# Altium project V5_BASE.PrjPcb
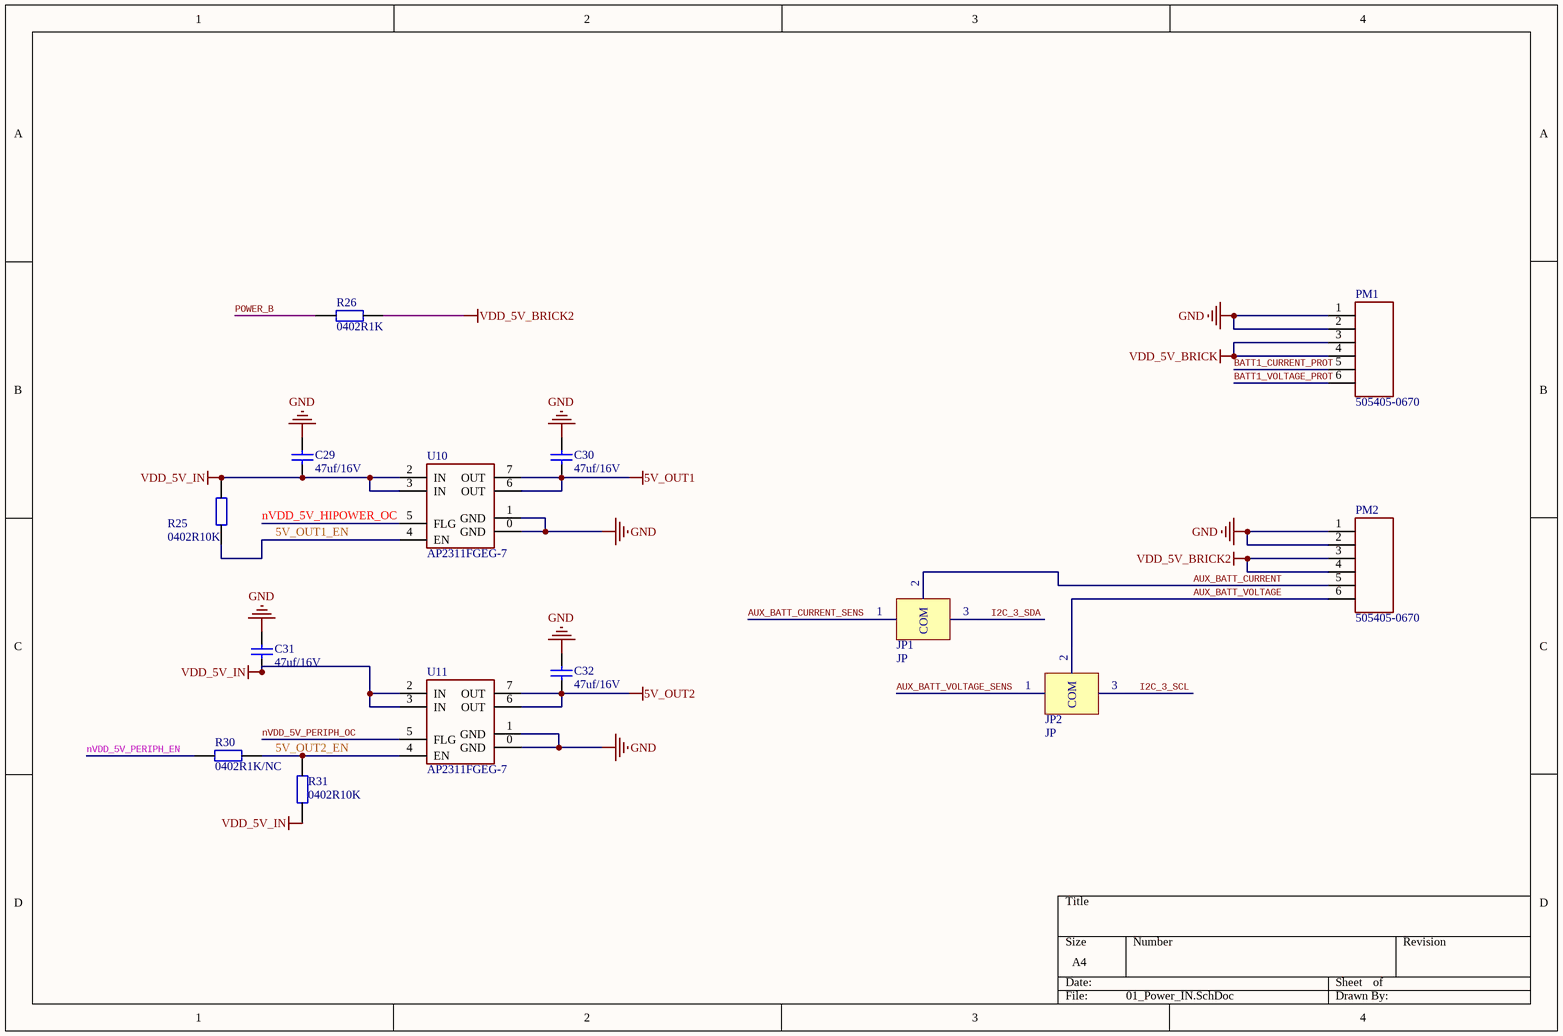
[diagram p0: 01_Power_IN.SchDoc]
3 sheets, 57 parts. Net scope: global (net labels, ports and power ports of the same name join across sheets).
Board file: V5_BASE_V15.PcbDoc
Sheets:
  01_Power_IN.SchDoc
  03_Power_Switch.SchDoc
  04_POWER_LDO.SchDoc

## Sheet 01_Power_IN.SchDoc
size A4

### Parts
C29  47uf/16V  [0805CAP]
C30  47uf/16V  [0805CAP]
C31  47uf/16V  [0805CAP]
C32  47uf/16V  [0805CAP]
JP1  JP  [0402R-SR]
JP2  JP  [0402R-SR]
PM1  505405-0670  [5054050660]
PM2  505405-0670  [5054050660]
R25  0402R10K  [0402R]
R26  0402R1K  [0402R]
R30  0402R1K/NC  [0402R]
R31  0402R10K  [0402R]
U10  AP2311FGEG-7  [QFN8_0.65]
U11  AP2311FGEG-7  [QFN8_0.65]

### Nets
5V_OUT1: C30.1 U10.6(OUT) U10.7(OUT)
5V_OUT2: C32.1 U11.6(OUT) U11.7(OUT)
GND: C29.2 C30.2 C31.2 C32.2 PM1.1 PM1.2 PM2.1 PM2.2 U10.0(GND) U10.1(GND) U11.0(GND) U11.1(GND)
VDD_5V_BRICK: PM1.3 PM1.4
VDD_5V_BRICK2: PM2.3 PM2.4 R26.2
VDD_5V_IN: C29.1 C31.1 R25.2 R31.2 U10.2(IN) U10.3(IN) U11.2(IN) U11.3(IN)  [project net VCC]
5V_OUT1_EN: R25.1 U10.4(EN)
5V_OUT2_EN: R30.1 R31.1 U11.4(EN)
AUX_BATT_CURRENT: JP1.2(COM) PM2.5
AUX_BATT_CURRENT_SENS: JP1.1
AUX_BATT_VOLTAGE: JP2.2(COM) PM2.6
AUX_BATT_VOLTAGE_SENS: JP2.1
BATT1_CURRENT_PROT: PM1.5
BATT1_VOLTAGE_PROT: PM1.6
I2C_3_SCL: JP2.3
I2C_3_SDA: JP1.3
nVDD_5V_HIPOWER_OC: U10.5(FLG)
nVDD_5V_PERIPH_EN: R30.2
nVDD_5V_PERIPH_OC: U11.5(FLG)
POWER_B: R26.1

### Library data of the parts
C29-C32 = Cap: Capacitor
JP1 JP2 = 0402R-SR
PM1 PM2 = 5054050660
R25 R26 R30 R31 = 0402R1K: 0402R1K 1%

## Sheet 03_Power_Switch.SchDoc
size A4
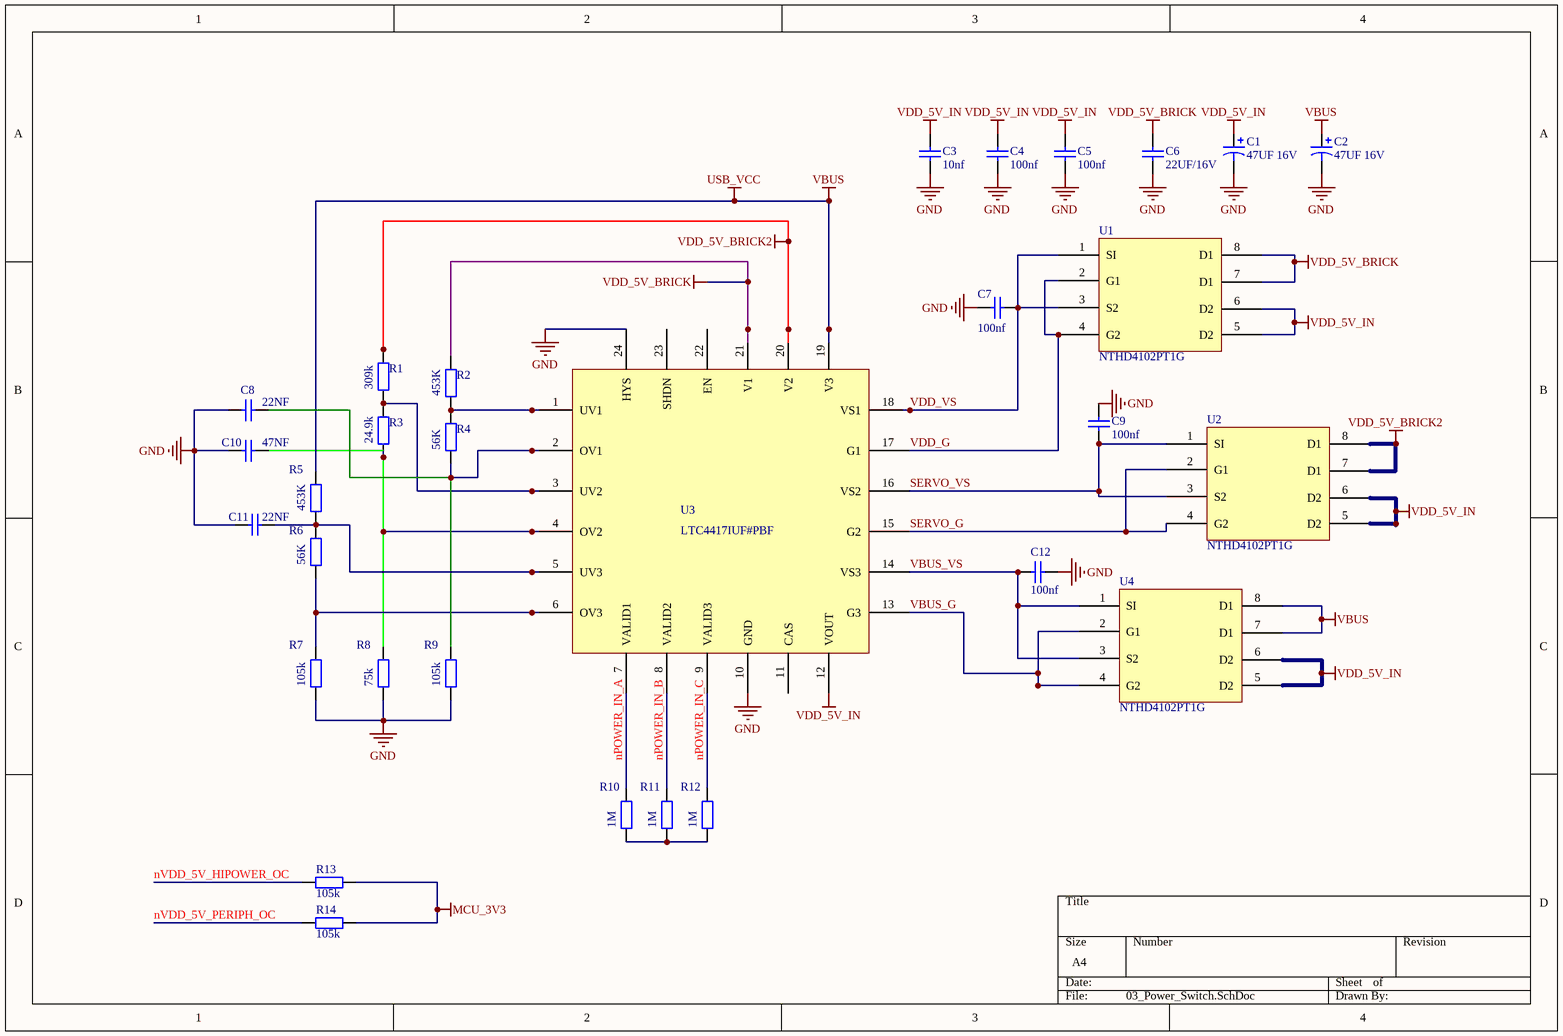
[diagram p1: 03_Power_Switch.SchDoc]

### Parts
C1  47UF 16V  [7343CAP]
C2  47UF 16V  [7343CAP]
C3  10nf  [0402CAP]
C4  100nf  [0402CAP]
C5  100nf  [0402CAP]
C6  22UF/16V  [0805CAP]
C7  100nf  [0402CAP]
C8  22NF  [0402CAP]
C9  100nf  [0402CAP]
C10  47NF  [0402CAP]
C11  22NF  [0402CAP]
C12  100nf  [0402CAP]
R1  309k  [R0402]
R2  453K  [R0402]
R3  24.9k  [R0402]
R4  56K  [R0402]
R5  453K  [R0402]
R6  56K  [R0402]
R7  105k  [R0402]
R8  75k  [R0402]
R9  105k  [R0402]
R10  1M  [R0402]
R11  1M  [R0402]
R12  1M  [R0402]
R13  105k  [R0402]
R14  105k  [R0402]
U1  NTHD4102PT1G  [1206-8]
U2  NTHD4102PT1G  [1206-8]
U3  LTC4417IUF#PBF  [QFN24]
U4  NTHD4102PT1G  [1206-8]

### Nets
GND: C1.C C2.C C3.1 C4.1 C5.1 C6.1 C7.2 C8.2 C9.2 C10.2 C11.2 C12.2 R7.1 R8.1 R9.1 U3.10(GND) U3.24(HYS)
MCU_3V3: R13.2 R14.2
USB_VCC: C2.A R5.2 U3.19(V3) U4.7(D1) U4.8(D1)  [also labelled VBUS]
VDD_5V_BRICK: C6.2 R2.2 U1.7(D1) U1.8(D1) U3.21(V1)
VDD_5V_BRICK2: R1.2 U2.7(D1) U2.8(D1) U3.20(V2)
VDD_5V_IN: C1.A C3.2 C4.2 C5.2 U1.5(D2) U1.6(D2) U2.5(D2) U2.6(D2) U3.12(VOUT) U4.5(D2) U4.6(D2)  [project net VCC]
nPOWER_IN_A: R10.2 U3.7(VALID1)
nPOWER_IN_B: R11.2 U3.8(VALID2)
nPOWER_IN_C: R12.2 U3.9(VALID3)
nVDD_5V_HIPOWER_OC: R13.1
nVDD_5V_PERIPH_OC: R14.1
SERVO_G: U2.2(G1) U2.4(G2) U3.15(G2)
SERVO_VS: C9.1 U2.1(SI) U2.3(S2) U3.16(VS2)
VBUS_G: U3.13(G3) U4.2(G1) U4.4(G2)
VBUS_VS: C12.1 U3.14(VS3) U4.1(SI) U4.3(S2)
VDD_G: U1.2(G1) U1.4(G2) U3.17(G1)
VDD_VS: C7.1 U1.1(SI) U1.3(S2) U3.18(VS1)
NetC8_1: C8.1 R4.1 R9.2 U3.2(OV1)
NetC10_1: C10.1 R3.1 R8.2 U3.4(OV2)
NetC11_1: C11.1 R5.1 R6.2 U3.5(UV3)
NetR1_1: R1.1 R3.2 U3.3(UV2)
NetR2_1: R2.1 R4.2 U3.1(UV1)
NetR6_1: R6.1 R7.2 U3.6(OV3)
NetR10_1: R10.1 R11.1 R12.1

Not connected (* = marked no-connect by the designer): U3 11(CAS) 22(EN) 23(SHDN)

### Library data of the parts
C1 C2 = Cap Pol1: Polarized Capacitor (Radial); Value: 100pF; Published: 8-Jun-2000; LatestRevisionDate: 17-Jul-2002; LatestRevisionNote: Re-released for DXP Platform.; PackageReference: RB7.6-15; Publisher: Altium Limited; PackageDescription: Polarized Capacitor (Radial); 2 Leads
C3-C12 = Cap: Value: 100pF; Published: 8-Jun-2000; LatestRevisionDate: 17-Jul-2002; LatestRevisionNote: Re-released for DXP Platform.; PackageReference: RAD-0.3; Publisher: Altium Limited; PackageDescription: Radial Cap, Thru-Hole; 2 Leads; 0.3 in Pin Spacing
R1-R14 = Res2: Resistor; Value: 1K; Published: 8-Jun-2000; LatestRevisionDate: 17-Jul-2002; LatestRevisionNote: Re-released for DXP Platform.; PackageReference: AXIAL-0.4; Publisher: Altium Limited; PackageDescription: Axial Device, Thru-Hole; 2 Leads; 0.4 in Pin Spacing

## Sheet 04_POWER_LDO.SchDoc
size A4
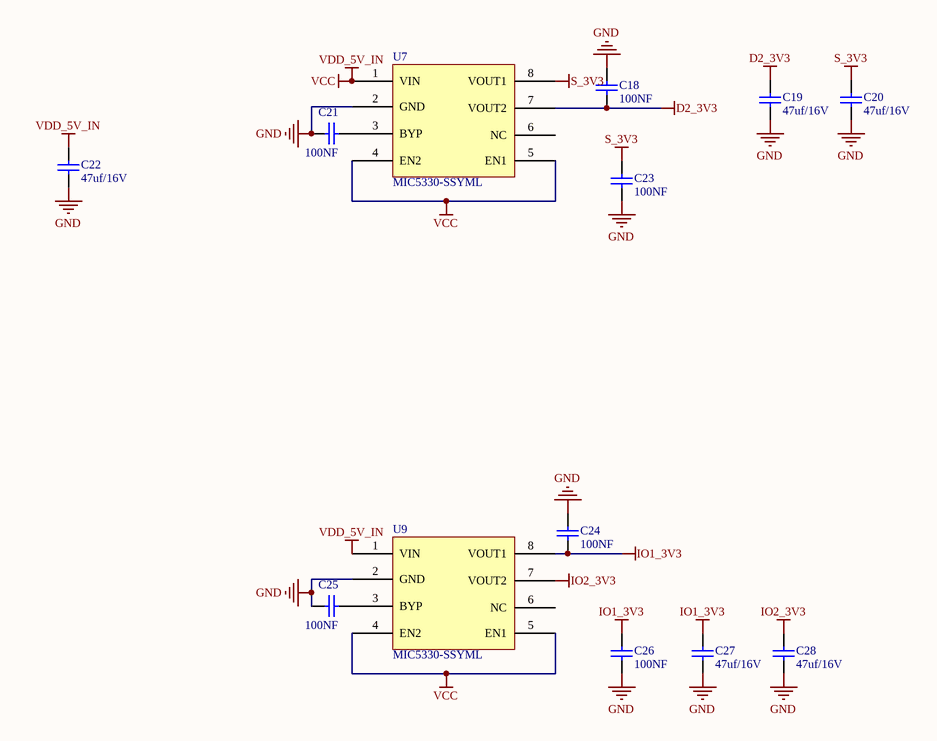
[diagram p2: 04_POWER_LDO.SchDoc]

### Parts
C18  100NF  [0402CAP]
C19  47uf/16V  [0805CAP]
C20  47uf/16V  [0805CAP]
C21  100NF  [0402CAP]
C22  47uf/16V  [0805CAP]
C23  100NF  [0402CAP]
C24  100NF  [0402CAP]
C25  100NF  [0402CAP]
C26  100NF  [0402CAP]
C27  47uf/16V  [0805CAP]
C28  47uf/16V  [0805CAP]
U7  MIC5330-SSYML  [MIC5530]
U9  MIC5330-SSYML  [MIC5530]

### Nets
D2_3V3: C18.1 C19.1 U7.7(VOUT2)
GND: C18.2 C19.2 C20.2 C21.2 C22.2 C23.1 C24.2 C25.2 C26.1 C27.2 C28.2 U7.2(GND) U9.2(GND)
IO1_3V3: C24.1 C26.2 C27.1 U9.8(VOUT1)
IO2_3V3: C28.1 U9.7(VOUT2)
S_3V3: C20.1 C23.2 U7.8(VOUT1)
VCC: C22.1 U7.1(VIN) U7.4(EN2) U7.5(EN1) U9.1(VIN) U9.4(EN2) U9.5(EN1)  [also labelled VDD_5V_IN]
NetC21_1: C21.1 U7.3(BYP)
NetC25_1: C25.1 U9.3(BYP)

Not connected (* = marked no-connect by the designer): U7 6(NC); U9 6(NC)

### Library data of the parts
C18 C21 C24 C25 = Cap: Value: 100pF; Published: 8-Jun-2000; LatestRevisionDate: 17-Jul-2002; LatestRevisionNote: Re-released for DXP Platform.; PackageReference: RAD-0.3; Publisher: Altium Limited; PackageDescription: Radial Cap, Thru-Hole; 2 Leads; 0.3 in Pin Spacing
C19 C20 C22 C27 C28 = Cap: Capacitor
C23 C26 = Cap
U7 U9 = MIC5530

## Nets that join several sheets
GND: 01_Power_IN (12 pins), 03_Power_Switch (17 pins), 04_POWER_LDO (13 pins)
VCC: 01_Power_IN (8 pins), 03_Power_Switch (11 pins), 04_POWER_LDO (7 pins)
VDD_5V_BRICK: 01_Power_IN (PM1.3 PM1.4), 03_Power_Switch (5 pins)
VDD_5V_BRICK2: 01_Power_IN (PM2.3 PM2.4 R26.2), 03_Power_Switch (R1.2 U2.7 U2.8 U3.20)
nVDD_5V_HIPOWER_OC: 01_Power_IN (U10.5), 03_Power_Switch (R13.1)
nVDD_5V_PERIPH_OC: 01_Power_IN (U11.5), 03_Power_Switch (R14.1)